# EAGLE schematic STOSAT1 (EAGLE 9.6.2)
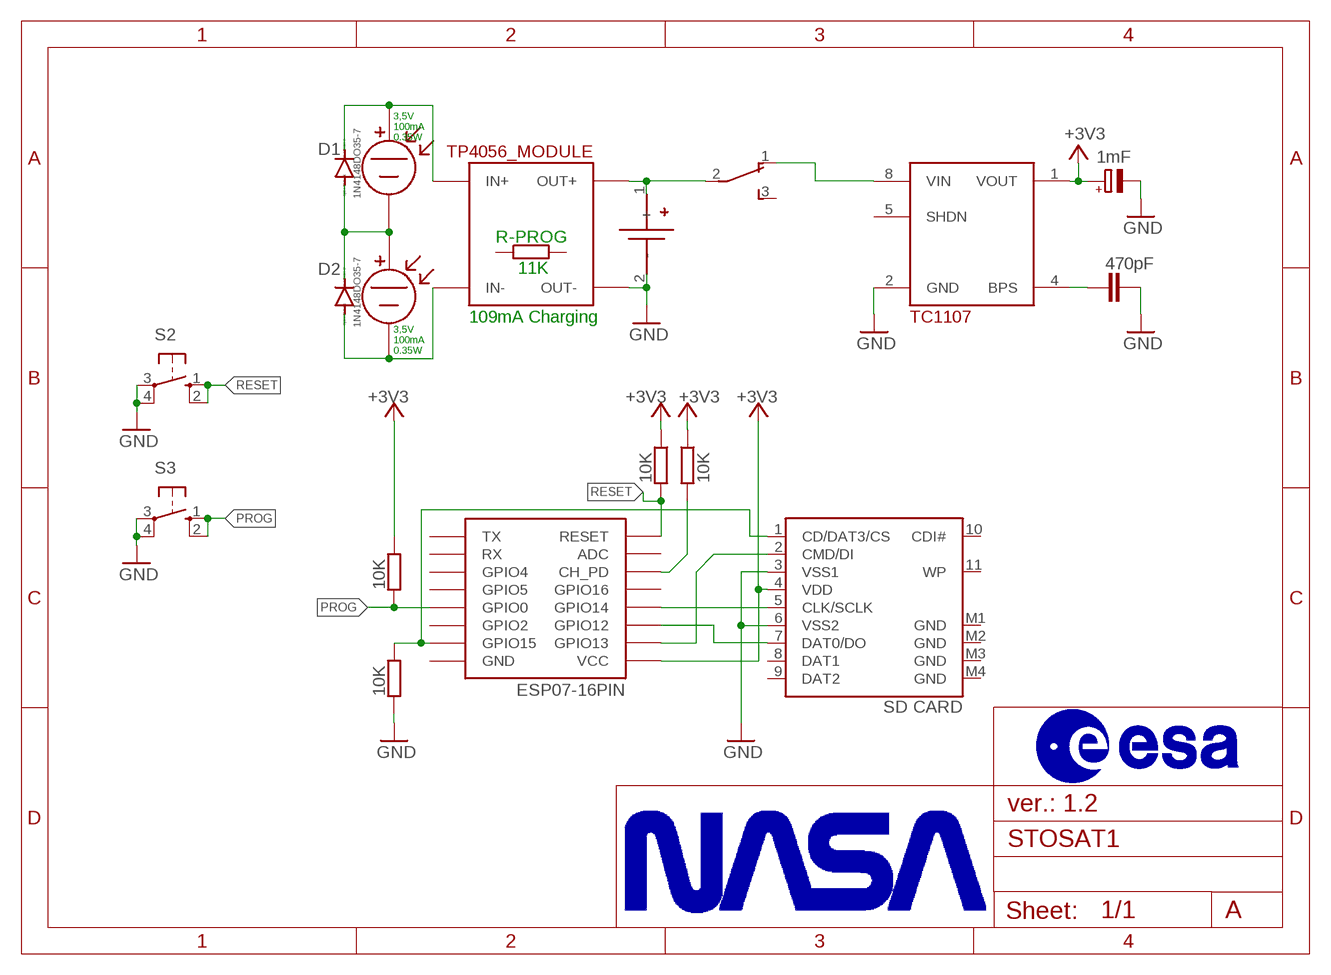
[diagram p0: schematic, sheet 1]

## Parts
C1  470pF  C-EU050-025X075  [C050-025X075]
C2  1mF  CPOL-EUE2.5-5  [E2,5-5]
D1  1N4148DO35-7  [DO35-7]
D2  1N4148DO35-7  [DO35-7]
J1  SD CARD  SDCARD  [SDCMF-10915W010]
R1  10K  R-EU_0207/10  [0207/10]
R2  10K  R-EU_0207/10  [0207/10]
R3  10K  R-EU_0207/10  [0207/10]
R4  10K  R-EU_0207/10  [0207/10]
S1  TL36YO  [TL3XYO]
S2  10-XX  [B3F-10XX]
S3  10-XX  [B3F-10XX]
U$1  ESP07-16PIN  [ESP07-16PIN]
U$2  SOLAR_CELL  [SOLAR_CELL]
U$3  TC1107  [SOIC127P600X175-8N]
U$4  TP4056_MODULE  [TP4056_MODULE]
U$5  BLOSSOM-BLM-18650-1PCS  [BLOSSOM-BLM-18650-1PCS]
U$6  SOLAR_CELL  [SOLAR_CELL]

## Nets
+3V3: C2.+ J1.4(VDD) R1.1 R2.1 R3.1 U$1.VCC U$3.1(VOUT)
GND: C1.2 C2.- J1.3(VSS1) J1.6(VSS2) R4.1 S2.3(P) S2.4(P1) S3.3(P) S3.4(P1) U$3.2(GND) U$4.P$3(OUT-) U$5.2(-)
N$1: D1.A D2.C U$2.P$2 U$6.P$1
N$2: J1.7(DAT0/DO) U$1.GPIO12
N$4: J1.2(CMD/DI) U$1.GPIO13
N$5: D1.C U$2.P$1 U$4.P$1(IN+)
N$6: J1.5(CLK/SCLK) U$1.GPIO14
N$7: S1.2(P) U$4.P$4(OUT+) U$5.1(+)
N$8: C1.1 U$3.4(BPS)
N$9: S1.1(O) U$3.8(VIN)
N$10: D2.A U$4.P$2(IN-) U$6.P$2
N$11: J1.1(CD/DAT3/CS) R4.2 U$1.GPIO15
N$13: R1.2 U$1.CH_PD
PROG: R3.2 S3.1(S) S3.2(S1) U$1.GPIO0
RESET: R2.2 S2.1(S) S2.2(S1) U$1.REST(RESET)
Unconnected: J1.8(DAT1) J1.9(DAT2) J1.10(CDI#) J1.11(WP) S1.3(S) U$1.ADC U$1.GND U$1.GPIO2 U$1.GPIO4 U$1.GPIO5 U$1.GPIO16 U$1.RX U$1.TX U$3.3(NC0) U$3.5(SHDN) U$3.6(NC2) U$3.7(NC1)

## Notes on the sheet
- 3,5V
  100mA
  0.35W
- R-PROG
- 11K
- 109mA Charging
- 3,5V
  100mA
  0.35W
- ver.: 1.2
- A

## Power pins joined to a net without a drawn wire
GND: J1.M1(GND) J1.M2(GND) J1.M3(GND) J1.M4(GND)

## Library data of the parts
C1 = rcl:C-EU: CAPACITOR, European symbol; SPICEPREFIX: C
C2 = rcl:CPOL-EU: POLARIZED CAPACITOR, European symbol; SPICEPREFIX: C
D1 D2 = diode:1N4148: DIODE high speed (Philips)
J1 = sd-mmc:SDCARD: SD card connector KINGFONT SDCMF-10915W010
R1-R4 = rcl:R-EU_: RESISTOR, European symbol; SPICEPREFIX: R
S1 = switch:TL36YO: TINY SWITCH ON - ON Source: http://www2.produktinfo.conrad.com/datenblaetter/700000-724999/705152-da-01-de-Subminiaturschalter_TL_36YO.pdf
S2 S3 = switch-omron:10-XX: OMRON SWITCH; MPN: B3F-1000; OC_FARNELL: 176432; OC_NEWARK: 36M3542
U$1 = esp8266modules:ESP07-16PIN: ESP8266 Wifi module 07 - 16 pins; DIMENSIONS: 22.0 x 16.0 mm; PINS: 16; PITCH: 0.078" / 2 mm
U$2 U$6 = g-eazy:SOLAR_CELL
U$3 = g-eazy:TC1107
U$4 = g-eazy:TP4056_MODULE
U$5 = battery-holders:BLOSSOM-BLM-18650-1PCS